# EAGLE design CanSharkV20 (EAGLE 6.3)

## Sheet 1 of 3
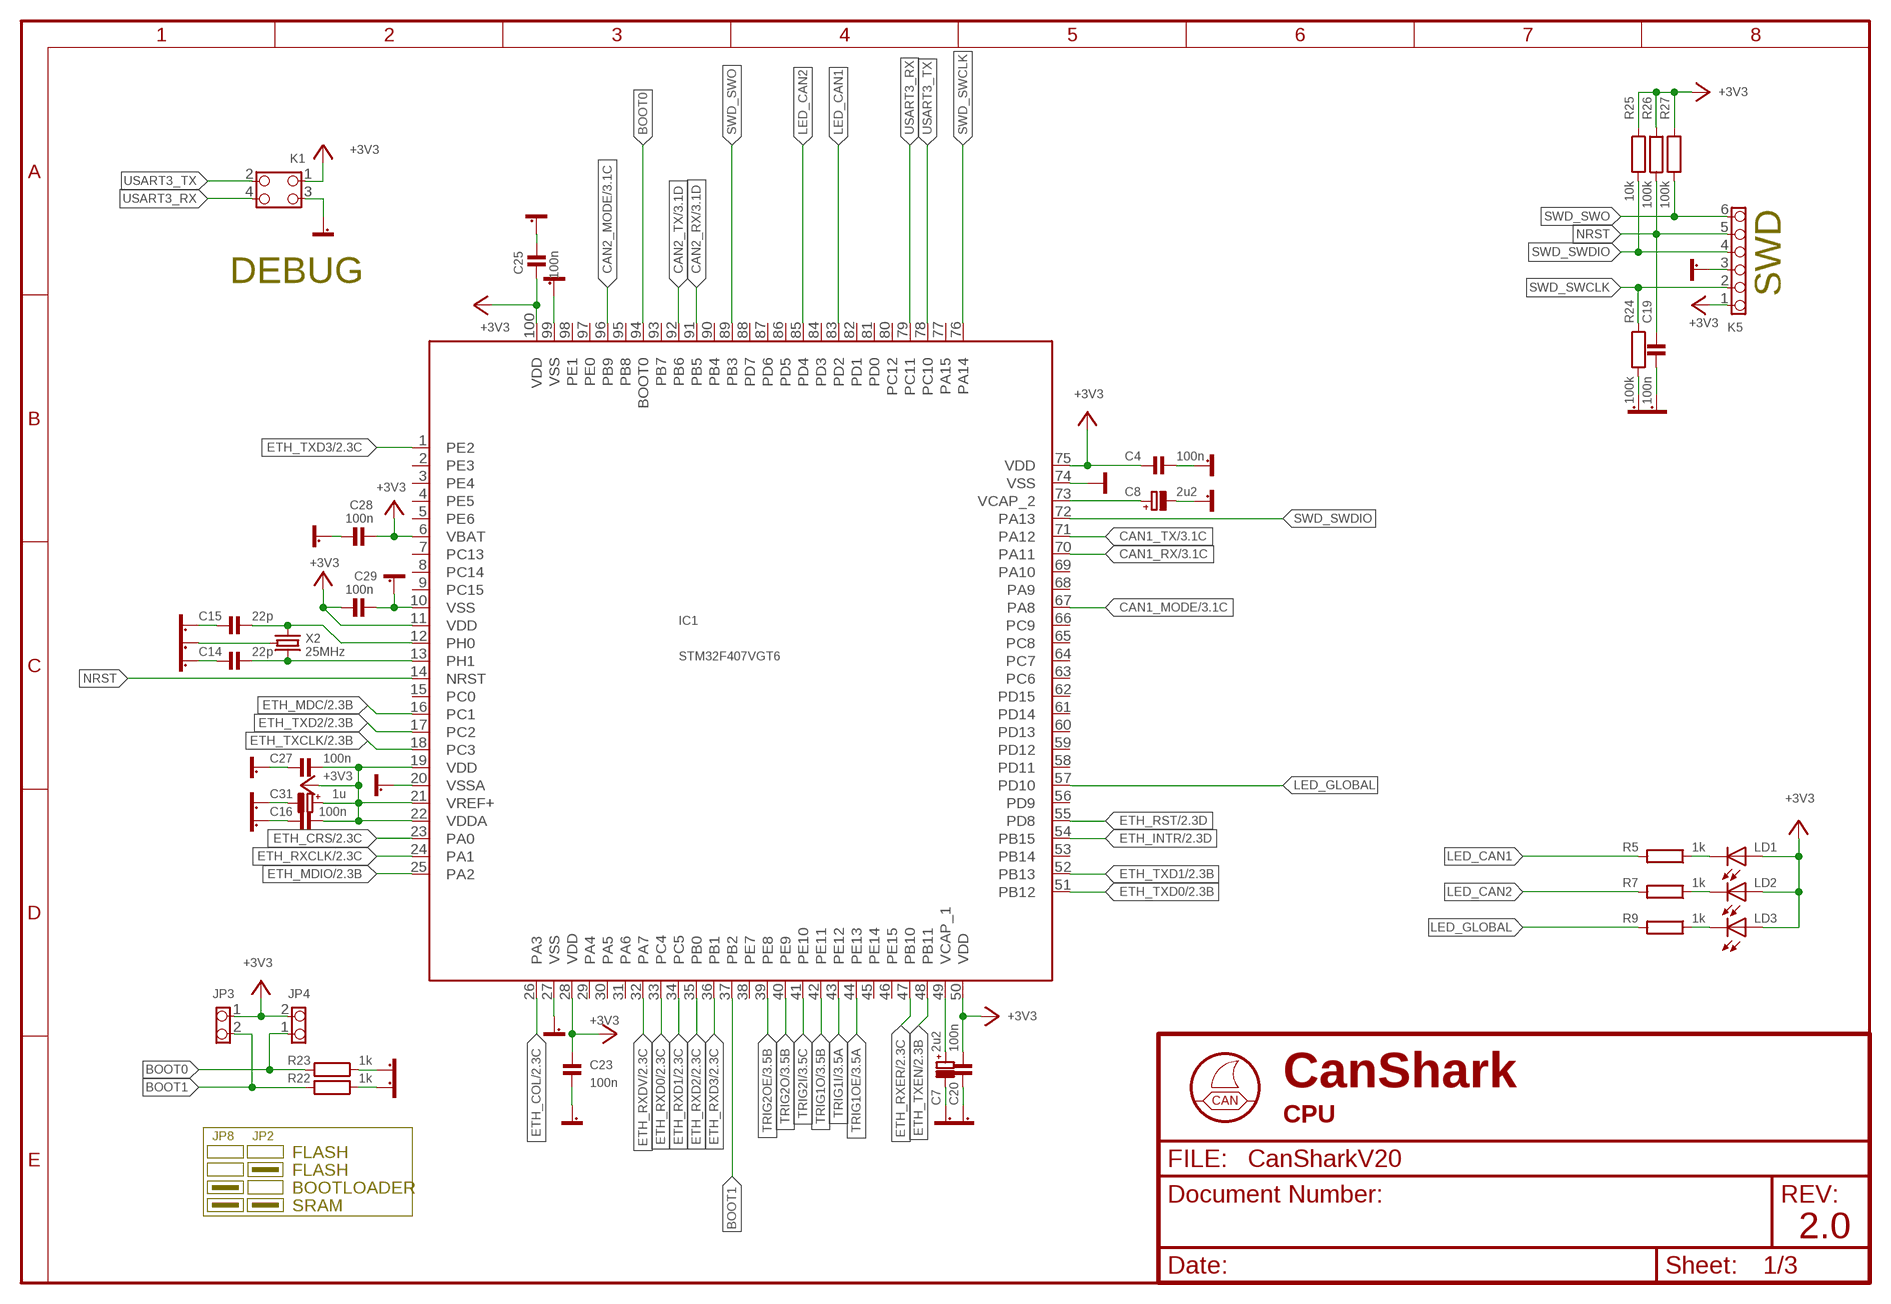
[diagram p0: schematic, sheet 1]

### Parts
C4  100n  C0603  [0603]
C7  2u2  CECT3216  [CT3216A]
C8  2u2  CECT3216  [CT3216A]
C14  22p  C0603  [0603]
C15  22p  C0603  [0603]
C16  100n  C0603  [0603]
C19  100n  C0603  [0603]
C20  100n  C0603  [0603]
C23  100n  C0603  [0603]
C25  100n  C0603  [0603]
C27  100n  C0603  [0603]
C28  100n  C0603  [0603]
C29  100n  C0603  [0603]
C31  1u  CECT3216  [CT3216A]
IC1  STM32F407VGT6  STM32F407V  [LQFP100]
JP3  PINHD-1X2  [1X02_254]
JP4  PINHD-1X2  [1X02_254]
K1  PINHD-2X2  [2X02_254]
K5  PINHD-1X6  [1X06_254]
LD1  TLLG4400  [LED3MM]
LD2  TLLG4400  [LED3MM]
LD3  TLLG4400  [LED3MM]
R5  1k  R_R0603  [0603]
R7  1k  R_R0603  [0603]
R9  1k  R_R0603  [0603]
R22  1k  R_R0603  [0603]
R23  1k  R_R0603  [0603]
R24  100k  R_R0603  [0603]
R25  100k  R_R0603  [0603]
R26  10k  R_R0603  [0603]
R27  100k  R_R0603  [0603]
X2  25MHz  X_GND_XT324  [X_XT324]

### Nets
+3V3: C4.2 C16.1 C20.1 C23.1 C25.2 C27.1 C28.2 C29.2 C31.+ IC1.6(VBAT) IC1.11(VDD) IC1.19(VDD) IC1.21(VREF+) IC1.22(VDDA) IC1.28(VDD) IC1.50(VDD) IC1.75(VDD) IC1.100(VDD) JP3.1 JP4.2 K1.1 K5.1 LD1.A LD2.A LD3.A R25.1 R26.2 R27.1 ; also sheet 2,3
BOOT0: IC1.94(BOOT0) JP4.1 R23.2
BOOT1: IC1.37(PB2) JP3.2 R22.2
CAN1_MODE: IC1.67(PA8) ; also sheet 3
CAN1_RX: IC1.70(PA11) ; also sheet 3
CAN1_TX: IC1.71(PA12) ; also sheet 3
CAN2_MODE: IC1.96(PB9) ; also sheet 3
CAN2_RX: IC1.91(PB5) ; also sheet 3
CAN2_TX: IC1.92(PB6) ; also sheet 3
ETH_COL: IC1.26(PA3) ; also sheet 2
ETH_CRS: IC1.23(PA0) ; also sheet 2
ETH_INTR: IC1.54(PB15) ; also sheet 2
ETH_MDC: IC1.16(PC1) ; also sheet 2
ETH_MDIO: IC1.25(PA2) ; also sheet 2
ETH_RST: IC1.55(PD8) ; also sheet 2
ETH_RXCLK: IC1.24(PA1) ; also sheet 2
ETH_RXD0: IC1.33(PC4) ; also sheet 2
ETH_RXD1: IC1.34(PC5) ; also sheet 2
ETH_RXD2: IC1.35(PB0) ; also sheet 2
ETH_RXD3: IC1.36(PB1) ; also sheet 2
ETH_RXDV: IC1.32(PA7) ; also sheet 2
ETH_RXER: IC1.47(PB10) ; also sheet 2
ETH_TXCLK: IC1.18(PC3) ; also sheet 2
ETH_TXD0: IC1.51(PB12) ; also sheet 2
ETH_TXD1: IC1.52(PB13) ; also sheet 2
ETH_TXD2: IC1.17(PC2) ; also sheet 2
ETH_TXD3: IC1.1(PE2) ; also sheet 2
ETH_TXEN: IC1.48(PB11) ; also sheet 2
GND: IC1.74(VSS)
GND1: C4.1 C7.- C8.- C14.2 C15.2 C16.2 C19.2 C20.2 C23.2 C25.1 C27.2 C28.1 C29.1 C31.- IC1.10(VSS) IC1.20(VSSA) IC1.27(VSS) IC1.99(VSS) K1.3 K5.3 R22.1 R23.1 R24.2 X2.2(G) X2.4(G) ; also sheet 2,3
LED_CAN1: IC1.83(PD2) R5.2
LED_CAN2: IC1.85(PD4) R7.2
LED_GLOBAL: IC1.57(PD10) R9.2
N$2: C7.+ IC1.49(VCAP_1)
N$4: C8.+ IC1.73(VCAP_2)
N$14: LD1.K(C) R5.1
N$20: LD2.K(C) R7.1
N$21: LD3.K(C) R9.1
NRST: C19.1 IC1.14(NRST) K5.5 R26.1
OSC_IN: C15.1 IC1.12(PH0) X2.1
OSC_OUT: C14.1 IC1.13(PH1) X2.3
SWD_SWCLK: IC1.76(PA14) K5.2 R24.1
SWD_SWDIO: IC1.72(PA13) K5.4 R25.2
SWD_SWO: IC1.89(PB3) K5.6 R27.2
TRIG1I: IC1.43(PE12) ; also sheet 3
TRIG1O: IC1.42(PE11) ; also sheet 3
TRIG1OE: IC1.44(PE13) ; also sheet 3
TRIG2I: IC1.41(PE10) ; also sheet 3
TRIG2O: IC1.40(PE9) ; also sheet 3
TRIG2OE: IC1.39(PE8) ; also sheet 3
USART3_RX: IC1.79(PC11) K1.4
USART3_TX: IC1.78(PC10) K1.2
Unconnected: IC1.2(PE3) IC1.3(PE4) IC1.4(PE5) IC1.5(PE6) IC1.7(PC13) IC1.8(PC14) IC1.9(PC15) IC1.15(PC0) IC1.29(PA4) IC1.30(PA5) IC1.31(PA6) IC1.38(PE7) IC1.45(PE14) IC1.46(PE15) IC1.53(PB14) IC1.56(PD9) IC1.58(PD11) IC1.59(PD12) IC1.60(PD13) IC1.61(PD14) IC1.62(PD15) IC1.63(PC6) IC1.64(PC7) IC1.65(PC8) IC1.66(PC9) IC1.68(PA9) IC1.69(PA10) IC1.77(PA15) IC1.80(PC12) IC1.81(PD0) IC1.82(PD1) IC1.84(PD3) IC1.86(PD5) IC1.87(PD6) IC1.88(PD7) IC1.90(PB4) IC1.93(PB7) IC1.95(PB8) IC1.97(PE0) IC1.98(PE1)

### Notes on the sheet
- DEBUG
- SWD
- CanShark
- CAN
- CPU
- JP8 | JP2
- FLASH
- FLASH
- BOOTLOADER
- SRAM
- 2.0

## Sheet 2 of 3
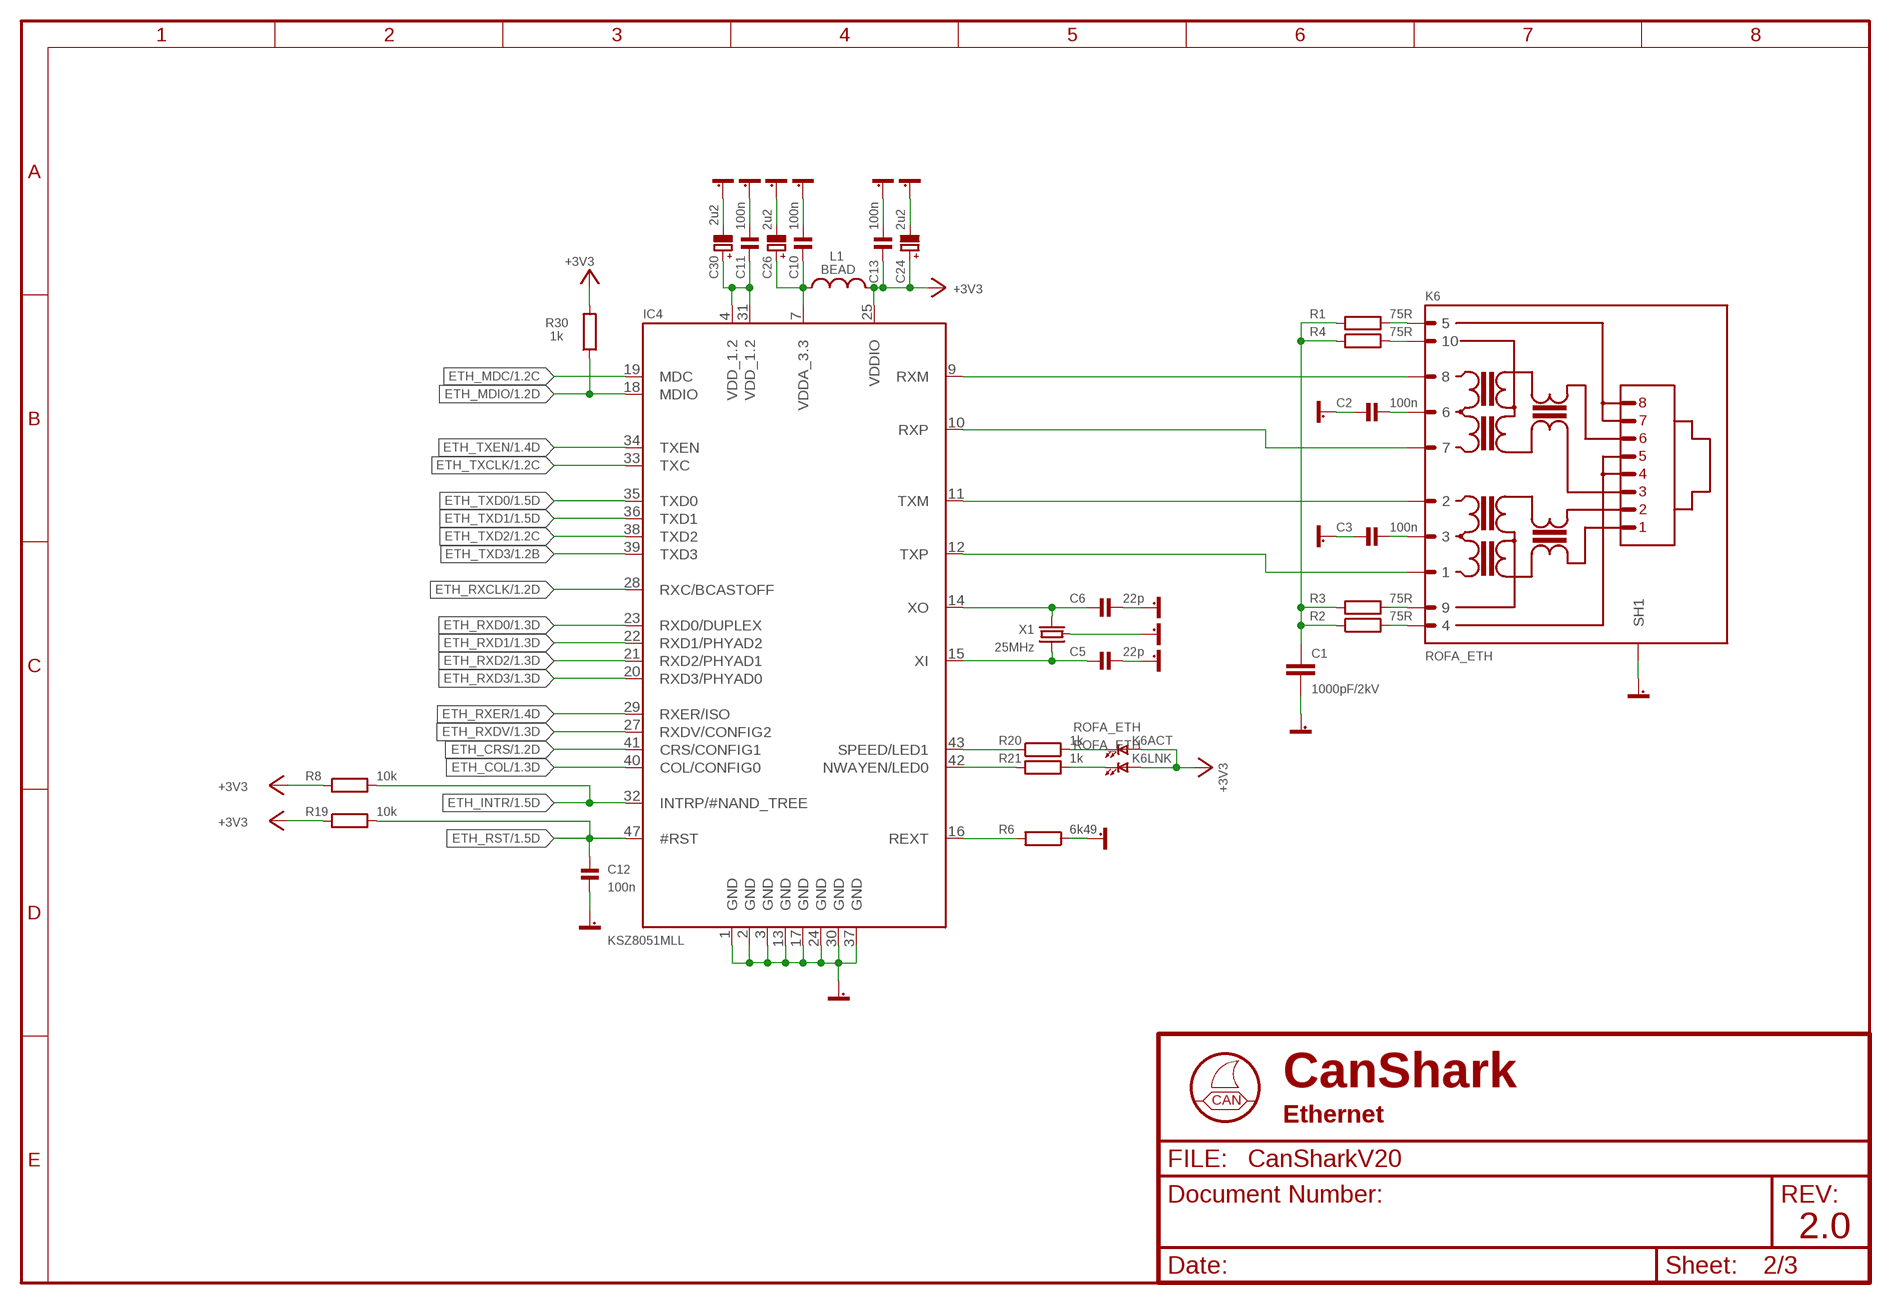
[diagram p1: schematic, sheet 2]

### Parts
C1  1000pF/2kV  KERAMICKYSMD1206  [SMD1206]
C2  100n  C0603  [0603]
C3  100n  C0603  [0603]
C5  22p  C0603  [0603]
C6  22p  C0603  [0603]
C10  100n  C0603  [0603]
C11  100n  C0603  [0603]
C12  100n  C0603  [0603]
C13  100n  C0603  [0603]
C24  2u2  CECT3216  [CT3216A]
C26  2u2  CECT3216  [CT3216A]
C30  2u2  CECT3216  [CT3216A]
IC4  KSZ8051MLL  [LQFP48]
K6  ROFA_ETH  RJ45_TRAFO  [RJ45_TRAFO]
L1  BEAD  L1206  [1206]
R1  75R  R_R0603  [0603]
R2  75R  R_R0603  [0603]
R3  75R  R_R0603  [0603]
R4  75R  R_R0603  [0603]
R6  6k49  R_R0603  [0603]
R8  10k  R_R0603  [0603]
R19  10k  R_R0603  [0603]
R20  1k  R_R0603  [0603]
R21  1k  R_R0603  [0603]
R30  1k  R_R0603  [0603]
X1  25MHz  X_GND_XT324  [X_XT324]

### Nets
+3V3: C13.2 C24.+ IC4.25(VDDIO) K6.A_G(A) K6.A_Y(A) L1.1 R8.1 R19.1 R30.2 ; also sheet 1,3
ETH_COL: IC4.40(COL/CONFIG0) ; also sheet 1
ETH_CRS: IC4.41(CRS/CONFIG1) ; also sheet 1
ETH_INTR: IC4.32(INTRP/#NAND_TREE) R8.2 ; also sheet 1
ETH_MDC: IC4.19(MDC) ; also sheet 1
ETH_MDIO: IC4.18(MDIO) R30.1 ; also sheet 1
ETH_RST: C12.1 IC4.47(#RST) R19.2 ; also sheet 1
ETH_RXCLK: IC4.28(RXC/BCASTOFF) ; also sheet 1
ETH_RXD0: IC4.23(RXD0/DUPLEX) ; also sheet 1
ETH_RXD1: IC4.22(RXD1/PHYAD2) ; also sheet 1
ETH_RXD2: IC4.21(RXD2/PHYAD1) ; also sheet 1
ETH_RXD3: IC4.20(RXD3/PHYAD0) ; also sheet 1
ETH_RXDV: IC4.27(RXDV/CONFIG2) ; also sheet 1
ETH_RXER: IC4.29(RXER/ISO) ; also sheet 1
ETH_TXCLK: IC4.33(TXC) ; also sheet 1
ETH_TXD0: IC4.35(TXD0) ; also sheet 1
ETH_TXD1: IC4.36(TXD1) ; also sheet 1
ETH_TXD2: IC4.38(TXD2) ; also sheet 1
ETH_TXD3: IC4.39(TXD3) ; also sheet 1
ETH_TXEN: IC4.34(TXEN) ; also sheet 1
GND1: C1.2 C2.1 C3.1 C5.1 C6.1 C10.1 C11.1 C12.2 C13.1 C24.- C26.- C30.- IC4.1(GND) IC4.2(GND) IC4.3(GND) IC4.13(GND) IC4.17(GND) IC4.24(GND) IC4.30(GND) IC4.37(GND) K6.SH1 K6.SH2(SH1) R6.1 X1.2(G) X1.4(G) ; also sheet 1,3
N$3: K6.K_Y(K) R20.2
N$8: K6.K_G(K) R21.2
N$9: C10.2 C26.+ IC4.7(VDDA_3.3) L1.2
N$36: C11.2 C30.+ IC4.4(VDD_1.2) IC4.31(VDD_1.2)
N$37: IC4.9(RXM) K6.8
N$38: IC4.10(RXP) K6.7
N$39: IC4.11(TXM) K6.2
N$40: IC4.12(TXP) K6.1
N$41: K6.4 R2.2
N$42: K6.9 R3.2
N$43: K6.10 R4.2
N$44: K6.5 R1.2
N$45: C1.1 R1.1 R2.1 R3.1 R4.1
N$46: C2.2 K6.6
N$47: C3.2 K6.3
N$49: IC4.16(REXT) R6.2
N$50: IC4.42(NWAYEN/LED0) R21.1
N$51: IC4.43(SPEED/LED1) R20.1
N$55: C6.2 IC4.14(XO) X1.3
N$56: C5.2 IC4.15(XI) X1.1

### Notes on the sheet
- CanShark
- CAN
- Ethernet
- 2.0

## Sheet 3 of 3
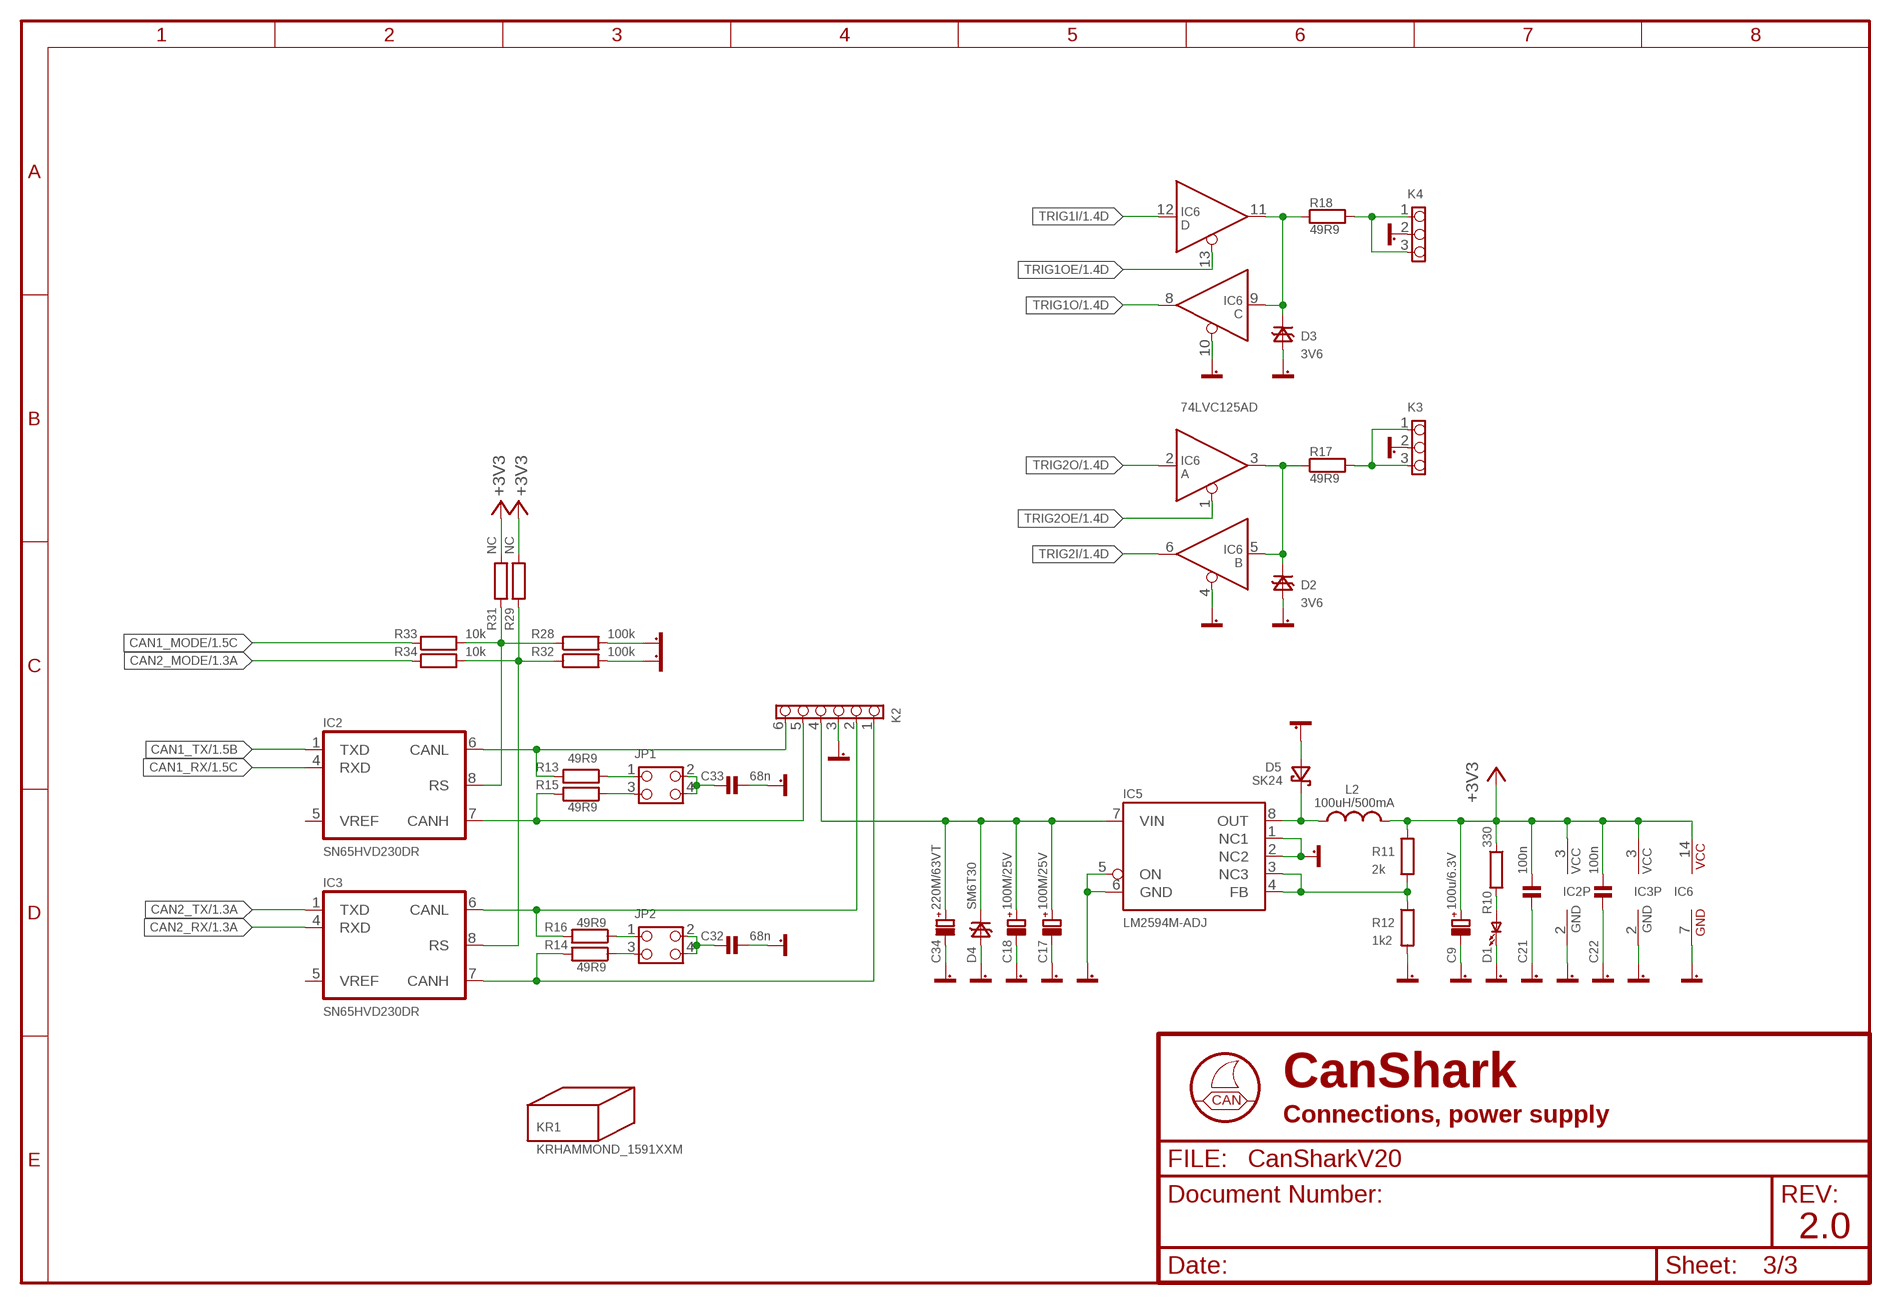
[diagram p2: schematic, sheet 3]

### Parts
C9  100u/6.3V  CECT3528  [CT3528B]
C17  100M/25V  CECT7343  [CT7343D]
C18  100M/25V  CECT7343  [CT7343D]
C21  100n  C0603  [0603]
C22  100n  C0603  [0603]
C32  68n  C0805  [0805]
C33  68n  C0805  [0805]
C34  220M/63VT  CE_D10L13_R  [CE_D10L13_R]
D1  LED0805  [LED_0805]
D2  3V6  D_TRANSIL_SMA  [D_SMA]
D3  3V6  D_TRANSIL_SMA  [D_SMA]
D4  SM6T30  D_TRANSIL_SMB  [D_SMB]
D5  SK24  D_SCHOTKY_SMB  [D_SMB]
IC2  SN65HVD230DR  MCP2551/S  [SO08]
IC3  SN65HVD230DR  MCP2551/S  [SO08]
IC5  LM2594M-ADJ  LM2594_SO  [SO08]
IC6  74LVC125AD  [SO14]
JP1  PINHD-2X2_254_EDGE  [2X02_254_EDGE]
JP2  PINHD-2X2_254_EDGE  [2X02_254_EDGE]
K2  PINHD-1X6_381_V  [1X06_381_V]
K3  PINHD-1X3  [1X03_254]
K4  PINHD-1X3  [1X03_254]
KR1  KRHAMMOND_1591XXM  [HAMMOND_1591XXM]
L2  100uH/500mA  L_MLC12XX  [L_MLC12XX]
R10  330  R_R0603  [0603]
R11  2k  R_R0603  [0603]
R12  1k2  R_R0603  [0603]
R13  49R9  R_R0805  [0805]
R14  49R9  R_R0805  [0805]
R15  49R9  R_R0805  [0805]
R16  49R9  R_R0805  [0805]
R17  49R9  R_R0805  [0805]
R18  49R9  R_R0805  [0805]
R28  100k  R_R0603  [0603]
R29  NC  R_R0603  [0603]
R31  NC  R_R0603  [0603]
R32  100k  R_R0603  [0603]
R33  10k  R_R0603  [0603]
R34  10k  R_R0603  [0603]

### Nets
+3V3: C9.+ C21.1 C22.1 IC2.3(VCC) IC3.3(VCC) IC6.14(P:VCC) L2.2 R10.1 R11.1 R29.1 R31.1 ; also sheet 1,2
CAN1_H: IC2.7(CANH) K2.5 R15.2
CAN1_L: IC2.6(CANL) K2.6 R13.2
CAN1_MODE: R33.1 ; also sheet 1
CAN1_RX: IC2.4(RXD) ; also sheet 1
CAN1_TX: IC2.1(TXD) ; also sheet 1
CAN2_H: IC3.7(CANH) K2.1 R14.2
CAN2_L: IC3.6(CANL) K2.2 R16.2
CAN2_MODE: R34.1 ; also sheet 1
CAN2_RX: IC3.4(RXD) ; also sheet 1
CAN2_TX: IC3.1(TXD) ; also sheet 1
EXTSUPPLY: C17.+ C18.+ C34.P(+) D4.K IC5.7(VIN) K2.4
GND1: C9.- C17.- C18.- C21.2 C22.2 C32.1 C33.1 C34.M(-) D1.K(C) D2.A D3.A D4.A D5.A IC2.2(GND) IC3.2(GND) IC5.1(NC1) IC5.2(NC2) IC5.5(ON) IC5.6(GND) IC6.4(B:OE) IC6.7(P:GND) IC6.10(C:OE) K2.3 K3.2 K4.2 R12.2 R28.2 R32.2 ; also sheet 1,2
N$1: D2.K IC6.3(A:Y) IC6.5(B:A) R17.1
N$5: JP2.1 R16.1
N$7: D1.A R10.2
N$10: JP2.3 R14.1
N$11: C32.2 JP2.2 JP2.4
N$12: IC2.8(RS) R28.1 R31.2 R33.2
N$16: JP1.1 R13.1
N$17: IC3.8(RS) R29.2 R32.1 R34.2
N$18: JP1.3 R15.1
N$19: C33.2 JP1.2 JP1.4
N$22: K4.1 K4.3 R18.2
N$24: K3.1 K3.3 R17.2
N$28: D5.K IC5.8(OUT) L2.1
N$29: IC5.3(NC3) IC5.4(FB) R11.2 R12.1
N$30: D3.K IC6.9(C:A) IC6.11(D:Y) R18.1
TRIG1I: IC6.12(D:A) ; also sheet 1
TRIG1O: IC6.8(C:Y) ; also sheet 1
TRIG1OE: IC6.13(D:OE) ; also sheet 1
TRIG2I: IC6.6(B:Y) ; also sheet 1
TRIG2O: IC6.2(A:A) ; also sheet 1
TRIG2OE: IC6.1(A:OE) ; also sheet 1
Unconnected: IC2.5(VREF) IC3.5(VREF)

### Notes on the sheet
- CanShark
- CAN
- Connections, power supply
- 2.0

## Library data of the parts
C1 = #Kondenzatory:KERAMICKY
C2-C6 C10-C16 C19-C23 C25 C27-C29 C32 C33 = !discrete:C: Kondenzator
C7-C9 C17 C18 C24 C26 C30 C31 C34 = !discrete:CE: Kondenzator Elektrolyt
D1 = !opto:LED: Dioda LED
D2 D3 = !discrete:D_TRANSIL: Transil Jednosmerny Typ Urm @ Irm Ubr @ Ibr Ucl @ Ipp Pouzdro SM6T30A 25.6V (1uA) 30V (1mA) 53V (75A) DO214AA (SMB)
D4 = !diody:D_TRANSIL: Transil Jednosmerny Typ Urm @ Irm Ubr @ Ibr Ucl @ Ipp Pouzdro SM6T30A 25.6V (1uA) 30V (1mA) 53V (75A) DO214AA (SMB)
D5 = !discrete:D_SCHOTKY: Dioda Schottkyho Typ Ur (Urpk] Uf I (Ipk] Pouzdro SD103B 30 V 200 mA DO35 BAT42 30 V 200 mA DO35 BAT43 30 V 200 mA DO35 BAT46 100 V 150 mA DO35 BAT47 20 V 350 mA DO35 BAT48 40 V 350 mA DO35 SK24 40 V (28V) 0.55V 2A (50A) DO214AA (SMB) SK26 60 V 0.65V 2A (50A) DO214AA (SMB)
IC1 = !ic_stm32:STM32F4*V: IC Mikrokontroler
IC2 IC3 = linear:MCP2551: IO - Budic
IC4 = !ic_micrel:KSZ8051MLL: IO - Ethernet PHY
IC5 = !stab:LM2594: Stabilizator spinany
IC6 = !ic_74xx:74*125A: IO - Budic
JP1 JP2 K1 = !pinhead:PINHD-2X2: Konektor 2 PIN dvourady
JP3 JP4 = !pinhead:PINHD-1X2: Konektor 2 PIN Typ Rastr Imax Umax Rmax Kontakt 2.54 mm 500 mA 125 V 50 mOhm krimp /90 2.54 mm 500 mA 125 V 50 mOhm krimp _MX5267 2.50 mm 2.5 A 250 V 20 mOhm krimp _MX53048 1.25 mm 800 mA 125 V 20 mOhm krimp _PV-3.81 3.81 mm 8 A 130 V 30 mOhm ?roub
K2 K5 = !pinhead:PINHD-1X6: Konektor 6 PIN Typ Rastr Imax Umax Rmax Kontakt 2.54 mm 500 mA 125 V 50 mOhm krimp /90 2.54 mm 500 mA 125 V 50 mOhm krimp _MX5267 2.50 mm 2.5 A 250 V 20 mOhm krimp _MX53048 1.25 mm 800 mA 125 V 20 mOhm krimp _PV-3.81 3.81 mm 8 A 130 V 30 mOhm Sroub _MPT 2.54 mm 6 A 125 V unspecified Sroub
K3 K4 = !pinhead:PINHD-1X3: Konektor 3 PIN Typ Rastr Imax Umax Rmax Kontakt 2.54 mm 500 mA 125 V 50 mOhm krimp /90 2.54 mm 500 mA 125 V 50 mOhm krimp _MX5267 2.50 mm 2.5 A 250 V 20 mOhm krimp _MX53048 1.25 mm 800 mA 125 V 20 mOhm krimp _PV-3.81 3.81 mm 8 A 130 V 30 mOhm ?roub
K6 = !konektor:RJ45_TRAFO: Konektor RJ45 RJ45 socket with LED and transofrmator Manufaturer: Wenzhou Yihua Communicated Connector Co. Ltd. Forward current LED = 20mA Typical voltage: Green LED Yellow LED 2.2V 2.1V c 2007 ROFA.CZ
KR1 = !krabicky:KR: Krabicka
L1 L2 = !discrete:L: Indukcnost
LD1-LD3 = led:TLLG4400: Low Current (2mA) LED 3 mm Tinted Diffused Package color GREEN Source: Data sheet <http://www.farnell.com/datasheets/391098.pdf>; MF: VISHAY SEMICONDUCTOR; OC_FARNELL: 1612435
R1-R34 = !discrete:R_: Rezistor
X1 X2 = !discrete:X_GND

## Board
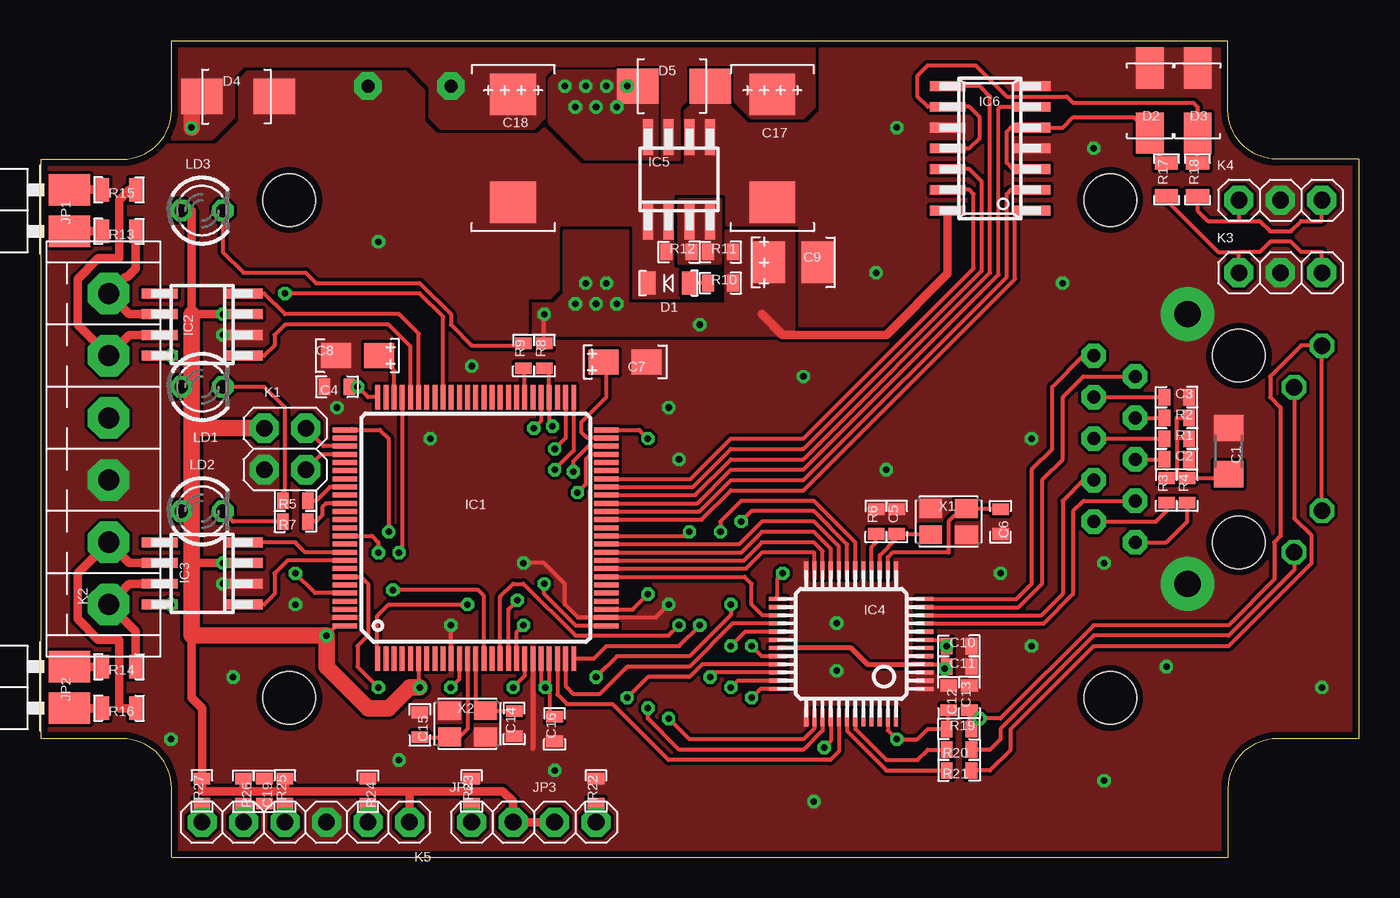
[diagram p3: board, top side]
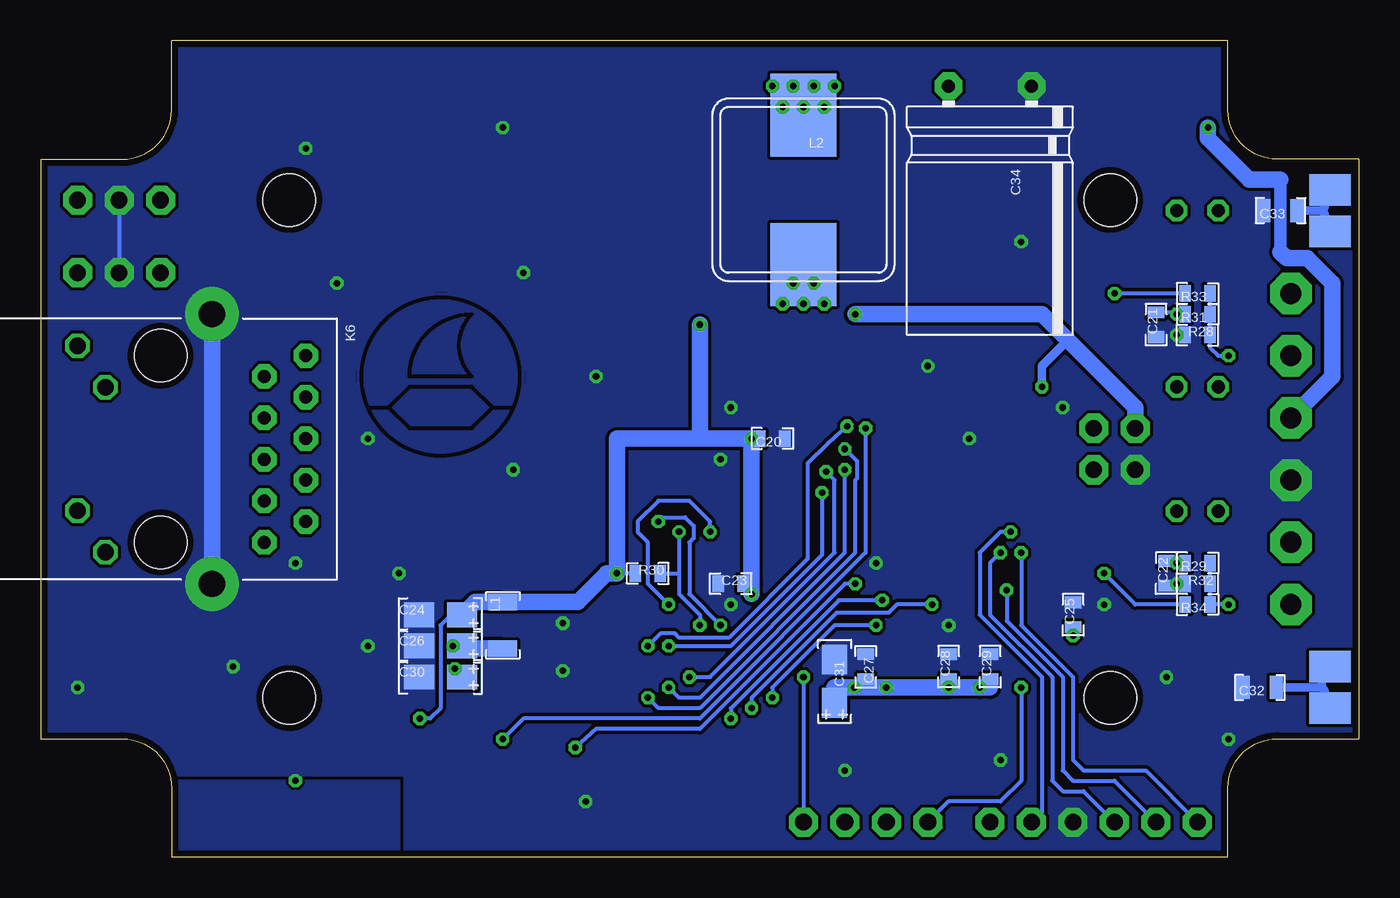
[diagram p4: board, bottom side, seen from below]

Size 80.7 x 50 mm. Coordinates in mm from the lower left corner, seen from the top.
Copper layers (1*16): Top 0.035mm / dielectric 1.5mm / Bottom 0.035mm
Design rules "default *": minimum track width 8mil, minimum drill 0.4mm, track to track 6mil, track to pad 6mil, pad to pad 6mil, via to via 6mil, smd to smd 0mil, copper to edge 0.4mm, drill to drill 8mil, minimum pad ring 10mil, minimum via ring 8mil, stop-mask expansion 4mil, vias tented up to drill 0mil, thermal gap 10mil
bRestrict: area 51.4,24.6 to 61.1,34.3; 11 lines

### Footprints (pad centres in the part's own frame; a part is rotated, then mirrored left to right if it is on the bottom)
SMD1206 = smd 1.6 x 1.803: 1 -1.422,0; 2 1.422,0
0603 = smd 0.711 x 1.016: 1 -0.762,0; 2 0.762,0
CT3216A = smd 1.829 x 1.524: + -1.321,0; - 1.321,0
CT3528B = smd 2.032 x 2.54: + -1.524,0; - 1.524,0
CT7343D = smd 2.54 x 2.794: + -3.302,0; - 3.302,0
0805 = smd 0.813 x 1.422: 1 -1.016,0; 2 1.016,0
CE_D10L13_R = drill 0.8 pad 1.676 octagon: M 0,2.54; P 0,-2.54
LED_0805 = smd 0.914 x 1.422: A -1.27,0; K 1.27,0
D_SMA = smd 2.515 x 1.702: A 2,0; K -2,0
D_SMB = smd 2.54 x 2.159: A 2.54,0; K -1.905,0
LQFP100 = smd 1.5 x 0.3: 1 -8,6; 2 -8,5.5; 3 -8,5; 4 -8,4.5; 5 -8,4; 6 -8,3.5; 7 -8,3; 8 -8,2.5; 9 -8,2; 10 -8,1.5; 11 -8,1; 12 -8,0.5; 13 -8,0; 14 -8,-0.5; 15 -8,-1; 16 -8,-1.5; 17 -8,-2; 18 -8,-2.5; 19 -8,-3; 20 -8,-3.5; 21 -8,-4; 22 -8,-4.5; 23 -8,-5; 24 -8,-5.5; 25 -8,-6; 51 8,-6; 52 8,-5.5; 53 8,-5; 54 8,-4.5; 55 8,-4; 56 8,-3.5; 57 8,-3; 58 8,-2.5; 59 8,-2; 60 8,-1.5; 61 8,-1; 62 8,-0.5; 63 8,0; 64 8,0.5; 65 8,1; 66 8,1.5; 67 8,2; 68 8,2.5; 69 8,3; 70 8,3.5; 71 8,4; 72 8,4.5; 73 8,5; 74 8,5.5; 75 8,6 | smd 0.3 x 1.5: 26 -6,-8; 27 -5.5,-8; 28 -5,-8; 29 -4.5,-8; 30 -4,-8; 31 -3.5,-8; 32 -3,-8; 33 -2.5,-8; 34 -2,-8; 35 -1.5,-8; 36 -1,-8; 37 -0.5,-8; 38 0,-8; 39 0.5,-8; 40 1,-8; 41 1.5,-8; 42 2,-8; 43 2.5,-8; 44 3,-8; 45 3.5,-8; 46 4,-8; 47 4.5,-8; 48 5,-8; 49 5.5,-8; 50 6,-8; 76 6,8; 77 5.5,8; 78 5,8; 79 4.5,8; 80 4,8; 81 3.5,8; 82 3,8; 83 2.5,8; 84 2,8; 85 1.5,8; 86 1,8; 87 0.5,8; 88 0,8; 89 -0.5,8; 90 -1,8; 91 -1.5,8; 92 -2,8; 93 -2.5,8; 94 -3,8; 95 -3.5,8; 96 -4,8; 97 -4.5,8; 98 -5,8; 99 -5.5,8; 100 -6,8
SO08 = smd 0.6 x 2.2: 1 -1.905,-2.6; 2 -0.635,-2.6; 3 0.635,-2.6; 4 1.905,-2.6; 5 1.905,2.6; 6 0.635,2.6; 7 -0.635,2.6; 8 -1.905,2.6
LQFP48 = smd 0.254 x 1.067: 1 -2.75,-4.504; 2 -2.25,-4.504; 3 -1.75,-4.504; 4 -1.25,-4.504; 5 -0.75,-4.504; 6 -0.25,-4.504; 7 0.25,-4.504; 8 0.75,-4.504; 9 1.25,-4.504; 10 1.75,-4.504; 11 2.25,-4.504; 12 2.75,-4.504; 25 2.75,4.504; 26 2.25,4.504; 27 1.75,4.504; 28 1.25,4.504; 29 0.75,4.504; 30 0.25,4.504; 31 -0.25,4.504; 32 -0.75,4.504; 33 -1.25,4.504; 34 -1.75,4.504; 35 -2.25,4.504; 36 -2.75,4.504 | smd 1.067 x 0.254: 13 4.504,-2.75; 14 4.504,-2.25; 15 4.504,-1.75; 16 4.504,-1.25; 17 4.504,-0.75; 18 4.504,-0.25; 19 4.504,0.25; 20 4.504,0.75; 21 4.504,1.25; 22 4.504,1.75; 23 4.504,2.25; 24 4.504,2.75; 37 -4.504,2.75; 38 -4.504,2.25; 39 -4.504,1.75; 40 -4.504,1.25; 41 -4.504,0.75; 42 -4.504,0.25; 43 -4.504,-0.25; 44 -4.504,-0.75; 45 -4.504,-1.25; 46 -4.504,-1.75; 47 -4.504,-2.25; 48 -4.504,-2.75
SO14 = smd 0.6 x 2.2: 1 -3.81,-2.6; 2 -2.54,-2.6; 3 -1.27,-2.6; 4 0,-2.6; 5 1.27,-2.6; 6 2.54,-2.6; 7 3.81,-2.6; 8 3.81,2.6; 9 2.54,2.6; 10 1.27,2.6; 11 0,2.6; 12 -1.27,2.6; 13 -2.54,2.6; 14 -3.81,2.6
2X02_254_EDGE = smd 1.93 x 2.54: 1 0,-1.778; 3 2.54,-1.778 | smd 1.93 x 2.54 bottom: 2 0,-1.778; 4 2.54,-1.778
1X02_254 = drill 1.016 pad 1.778 octagon: 1 -1.27,0; 2 1.27,0
2X02_254 = drill 1.016 pad 1.778 octagon: 1 -1.27,-1.27; 2 -1.27,1.27; 3 1.27,-1.27; 4 1.27,1.27
1X06_381_V = drill 1.3 pad 2.54 octagon: 1 0,0; 2 3.81,0; 3 7.62,0; 4 11.43,0; 5 15.24,0; 6 19.05,0
1X03_254 = drill 1.016 pad 1.778 octagon: 1 -2.54,0; 2 0,0; 3 2.54,0
1X06_254 = drill 1.016 pad 1.778 octagon: 1 -6.35,0; 2 -3.81,0; 3 -1.27,0; 4 1.27,0; 5 3.81,0; 6 6.35,0
RJ45_TRAFO = drill 0.8 pad 1.5 octagon: 1 -5.715,8.89; 2 -4.445,6.35; 3 -3.175,8.89; 4 -1.905,6.35; 5 -0.635,8.89; 6 0.635,6.35; 7 1.905,8.89; 8 3.175,6.35; 9 4.445,8.89; 10 5.715,6.35 | drill 1 pad 1.5 octagon: A_G -6.325,-5.08; A_Y 3.785,-5.08; K_G -3.785,-3.38; K_Y 6.325,-3.38 | drill 1.6 pad 3.3: SH1 -8.255,3.15; SH2 8.255,3.15 | hole 3.2: -5.715,0; 5.715,0
HAMMOND_1591XXM = hole 3.2: 25.135,-15.25; -25.135,-15.25; 25.135,15.25; -25.135,15.25
1206 = smd 1.016 x 1.778: 1 -1.422,0; 2 1.422,0
L_MLC12XX = smd 5.08 x 4.064: 1 -4.572,0; 2 4.572,0
LED3MM = drill 0.813 octagon: A -1.27,0; K 1.27,0
X_XT324 = smd 1.4 x 1.15: 1 -1.1,-0.8; 2 1.1,-0.8; 3 1.1,0.8; 4 -1.1,0.8

### Placement (x,y rotation side)
C1  72.73,24.87 90 top
C2  69.56,24.36 180 top
C3  69.56,28.18 180 top
C4  18.12,28.81 0 top
C5  52.41,20.55 270 top
C6  58.77,20.55 90 top
C7  35.78,30.33 0 top
C8  19.4,30.71 180 top
C9  46.06,36.43 0 top
C10  56.23,12.94 180 top
C11  56.23,11.66 180 top
C12  55.59,9.76 90 top
C13  56.86,9.76 270 top
C14  28.98,8.17 270 top
C15  23.21,8.11 90 top
C16  31.46,7.86 270 top
C17  44.8,43.41 270 top
C18  28.92,43.41 270 top
C19  13.68,4.05 90 top
C20  35.91,25.64 0 bottom
C21  12.41,32.62 270 bottom
C22  11.78,17.38 270 bottom
C23  38.45,16.74 180 bottom
C24  56.23,14.84 180 bottom
C25  17.49,14.84 270 bottom
C26  56.23,12.94 180 bottom
C27  30.19,11.66 90 bottom
C28  25.11,11.66 270 bottom
C29  22.57,11.66 270 bottom
C30  56.23,11.03 180 bottom
C31  32.09,10.78 90 bottom
C32  6.06,10.39 0 bottom
C33  4.79,39.61 0 bottom
C34  22.57,47.23 270 bottom
D1  38.45,35.16 180 top
D2  67.91,46.34 90 top
D3  70.83,46.34 90 top
D4  11.78,46.59 0 top
D5  38.45,47.23 0 top
IC1  26.63,20.17 90 top
IC2  9.87,32.62 90 top
IC3  9.87,17.38 90 top
IC4  49.62,13.06 90 top
IC5  39.08,41.51 0 top
IC6  58.13,43.41 90 top
JP1  -0.04,38.34 90 top
JP2  -0.04,9.12 90 top
JP3  32.73,2.14 0 top
JP4  27.65,2.14 0 top
K1  14.95,25 270 top
K2  4.16,15.47 90 top
K3  75.91,35.8 0 top
K4  75.91,40.24 0 top
K5  16.22,2.14 180 top
K6  73.37,25 270 bottom
KR1  40.35,25 0 top
L1  52.41,14.21 270 bottom
L2  34,40.88 270 bottom
LD1  9.87,28.81 0 top
LD2  9.87,21.19 0 top
LD3  9.87,39.61 0 top
R1  69.56,25.64 180 top
R2  69.56,26.91 180 top
R3  68.92,22.46 270 top
R4  70.19,22.46 270 top
R5  15.59,21.82 0 top
R6  51.15,20.55 270 top
R7  15.59,20.55 0 top
R8  30.83,30.71 270 top
R9  29.55,30.71 270 top
R10  41.62,35.16 180 top
R11  41.62,37.06 180 top
R12  39.08,37.06 180 top
R13  4.79,38.34 0 top
R14  4.79,11.66 0 top
R15  4.79,40.88 0 top
R16  4.79,9.12 0 top
R17  68.92,41.51 270 top
R18  70.83,41.51 270 top
R19  56.23,7.86 180 top
R20  56.23,6.59 0 top
R21  56.23,5.32 0 top
R22  34,4.05 270 top
R23  26.38,4.05 270 top
R24  20.03,4.05 90 top
R25  14.95,4.05 270 top
R26  12.41,4.05 90 top
R27  9.87,4.05 270 top
R28  9.87,31.98 180 bottom
R29  9.87,18.02 0 bottom
R30  43.52,17.38 180 bottom
R31  9.87,33.26 0 bottom
R32  9.87,16.74 180 bottom
R33  9.87,34.52 0 bottom
R34  9.87,15.47 0 bottom
X1  55.59,20.55 0 top
X2  26.13,8.17 0 top

### Tracks (layer width: path | path; a pad name or v marks a point on that pad's centre or on a via)
+3V3  (via drill 0.4)
  Top 0.254: R19.1 56.86,7.98 56.86,8.49 | 56.86,8.49 C13.2 | IC2.3 v11.14,33.26 | 25.62,12.16 25.62,10.9 v25.11,10.39 | IC1.6 23.13,10.47 v23.21,10.39 | IC1.100 18.09,14.17 v17.49,13.57 | IC1.19 29.63,11.11 v28.92,10.39 | IC1.21 30.63,10.65 v30.89,10.39 | IC1.22 31.13,10.64 v30.89,10.39 | v30.89,10.39 31.14,10.14 31.14,8.93 C16.1 | IC1.28 36.24,15.17 v37.18,16.11 | 56.86,8.49 v57.5,8.49 58.77,8.49 64.48,14.21 72.73,14.21 75.53,17 75.53,19.29 75.91,19.67 75.91,27.54 75.28,28.18 75.28,29.45 77.18,31.35 78.45,31.35 K6.A_G K6.A_Y | IC1.50 36.64,26.17 v37.18,25.64 | IC3.3 v11.14,18.02 | IC1.75 20.03,28.17 v19.4,28.81 C4.2 | IC4.25 45.12,17.07 v45.43,17.38 | R8.1 v30.83,33.26
  Top 0.305: 25.62,12.16 IC1.11
  Top 0.508: JP3.1 JP4.2 28.92,3.41 28.29,4.05 22.57,4.05 | 22.57,4.05 K5.1 | 22.57,4.05 14.95,4.05 | 14.95,4.05 12.41,4.05 | 12.41,4.05 9.87,4.05 R27.1 9.87,9.12 9.24,9.76 9.24,13.57 | R26.2 12.41,4.05 | R25.1 14.95,4.05 | 9.24,18.02 v11.14,18.02 | v11.14,33.26 9.24,33.26 9.24,39.61 LD3.A | IC6.14 55.53,35.73 51.78,31.98 45.43,31.98 44.16,33.26
  Top 1.016: v23.21,10.39 22.57,10.39 21.3,9.12 20.03,9.12 17.49,11.66 v17.49,13.57 9.24,13.57 9.24,18.02 9.24,21.19 | 9.24,26.27 K1.1 | 9.24,26.27 9.24,21.19 | LD1.A 9.24,28.81 | 9.24,28.81 9.24,26.27 | 9.24,28.81 9.24,33.26 | LD2.A 9.24,21.19
  Bottom 0.254: R31.1 v11.14,33.26 11.27,33.38 C21.1 | v25.11,10.39 C28.2 | v17.49,13.57 C25.2 | C29.2 22.57,10.39 | C27.1 30.19,10.39 | v37.18,25.64 C20.1 | v33.37,35.16 34,35.16 L2.2 | C24.+ 55.59,14.84 56.23,14.21 56.23,9.12 56.86,8.49 v57.5,8.49 | R30.2 v45.43,17.38 | C23.1 37.18,16.74 | R29.1 v11.14,18.02 11.27,18.14 C22.1
  Bottom 0.508: v19.4,28.81 19.4,30.08 17.81,31.67
  Bottom 1.016: C24.+ 54.12,15.63 L1.1 47.82,15.63 46.06,17.38 v45.43,17.38 45.43,25.64 40.35,25.64 | 22.57,10.39 v23.21,10.39 v25.11,10.39 v28.92,10.39 30.19,10.39 v30.89,10.39 32.09,10.39 C31.+ | v37.18,16.11 37.18,16.74 v37.18,25.64 40.35,25.64 | v30.83,33.26 19.4,33.26 17.81,31.67 13.68,27.54 K1.1 | 40.35,25.64 v40.35,32.62
  other vias: 34.64,35.16 34,33.89 35.27,33.89 32.73,33.89
  pour Top (rank 2, no thermals): 42,38.34 46.06,38.34 46.06,31.98 30.19,31.98 30.19,33.89 31.46,33.89 32.09,34.52 32.09,38.34 35.91,38.34 35.91,33.89 42,33.89
BOOT0  (via drill 0.4)
  Top 0.254: IC1.94 19.6,17.17 20.03,16.74 20.03,13.57 19.4,12.94 19.4,11.66 v20.67,10.39 | R23.2 JP4.1
  Bottom 0.254: v20.67,10.39 20.67,4.68 21.94,3.41 25.11,3.41 JP4.1
BOOT1  (via drill 0.4)
  Top 0.254: IC1.37 39.47,19.67 v39.72,19.92 | v42.26,15.47 42.26,14.84 39.72,12.3 35.27,12.3 v34,11.03 | R22.2 JP3.2
  Bottom 0.254: v39.72,19.92 39.72,20.55 40.98,21.82 42.89,21.82 44.16,20.55 44.16,19.92 43.52,19.29 43.52,16.74 v42.26,15.47 | v34,11.03 JP3.2
CAN1_H
  Top 0.508: IC2.7 5.43,31.98 K2.5 2.25,32.62 2.25,35.41 3.52,36.68 4.79,36.68 4.79,40.24 5.43,40.88 R15.2
CAN1_L
  Top 0.508: IC2.6 5.43,33.26 K2.6 5.17,35.54 5.3,35.54 5.81,36.05 R13.2
CAN1_MODE  (via drill 0.4)
  Top 0.254: IC1.67 24.63,33.1 23.21,34.52 v14.95,34.52
  Bottom 0.254: R33.1 v14.95,34.52
CAN1_RX
  Top 0.254: IC2.4 13.68,34.52 14.95,33.26 21.94,33.26 23.13,32.06 IC1.70
CAN1_TX
  Top 0.254: IC1.71 22.63,31.29 21.3,32.62 14.95,32.62 14.32,31.98 14.32,31.35 13.68,30.71 IC2.1
CAN2_H
  Top 0.508: R14.2 5.81,13.82 K2.1 5.43,16.74 IC3.7
CAN2_L
  Top 0.508: IC3.6 5.43,18.02 K2.2 2.25,17.38 2.25,14.59 3.52,13.32 4.79,13.32 4.79,9.12 R16.2
CAN2_MODE  (via drill 0.4)
  Top 0.254: IC1.96 16.79,16.17 v15.59,17.38
  Bottom 0.254: R34.1 13.68,15.47 v15.59,17.38
CAN2_RX
  Top 0.254: IC1.91 16.2,18.67 15.59,19.29 IC3.4
CAN2_TX
  Top 0.254: IC1.92 15.11,18.17 14.32,17.38 14.32,16.11 13.68,15.47 IC3.1
ETH_COL  (via drill 0.4)
  Top 0.254: IC4.40 48.37,7.11 v47.97,6.71 | IC1.26 32.76,14.17 30.83,16.11 v30.83,16.74
  Bottom 0.254: v30.83,16.74 31.46,16.74 40.35,7.86 46.7,7.86 v47.97,6.71
ETH_CRS
  Top 0.254: IC1.23 31.63,9.97 32.22,9.38 35.02,9.38 38.45,5.95 48.35,5.95 48.87,6.47 IC4.41
ETH_INTR  (via drill 0.4)
  Top 0.254: IC4.32 44.15,12.31 v43.52,12.94 | v31.33,26.4 31.13,26.6 IC1.54 31.13,29.64 R8.2
  Bottom 0.254: v31.33,26.4 32.48,25.38 33.75,24.11 33.75,18.27 38.57,13.44 41.62,13.44 41.87,13.7 42.76,13.7 v43.52,12.94
ETH_MDC  (via drill 0.4)
  Top 0.254: IC1.16 28.13,15.96 28.92,16.74 29.55,16.74 32.73,13.57 38.45,13.57 v39.08,14.21 | IC4.19 49.37,19.15 47.34,21.19 43.52,21.19 v42.89,20.55
  Bottom 0.254: v42.89,20.55 42.64,20.81 41.24,20.81 40.73,20.3 40.73,19.54 40.98,19.29 40.98,16.11 v39.08,14.21
ETH_MDIO  (via drill 0.4)
  Top 0.254: v40.35,14.21 39.08,12.94 34.64,12.94 33.87,12.17 IC1.25 | IC4.18 49.87,19.29 47.34,21.82 42.89,21.82 41.62,20.55 v41.62,19.92
  Bottom 0.254: v41.62,19.92 41.62,17.38 | R30.1 41.62,17.38 | 41.62,17.38 41.62,16.11 40.35,14.84 v40.35,14.21
ETH_RST  (via drill 0.4)
  Top 0.254: C12.1 55.59,7.98 R19.2 54.32,7.86 53.69,7.22 v52.41,7.22 51.87,7.76 IC4.47 | IC1.55 30.63,26.71 v30.19,26.27
  Bottom 0.254: v30.19,26.27 30.19,18.65 40.35,8.49 51.15,8.49 v52.41,7.22
ETH_RXCLK
  Top 0.254: IC4.28 42.36,14.31 39.72,11.66 35.91,11.66 34.25,10.01 32.6,10.01 32.13,10.48 IC1.24
ETH_RXD0
  Top 0.254: IC4.23 47.37,18.61 47.34,18.65 44.16,18.65 43.18,17.67 IC1.33
ETH_RXD1
  Top 0.254: IC4.22 47.87,18.75 47.34,19.29 44.16,19.29 43.05,18.17 IC1.34
ETH_RXD2
  Top 0.254: IC4.21 48.37,18.88 47.34,19.92 44.16,19.92 42.91,18.67 IC1.35
ETH_RXD3
  Top 0.254: IC4.20 48.87,19.02 47.34,20.55 44.16,20.55 42.78,19.17 IC1.36
ETH_RXDV
  Top 0.254: IC1.32 43.1,17.17 43.52,16.74 43.52,15.47 44.19,14.81 IC4.27
ETH_RXER  (via drill 0.4)
  Top 0.254: IC1.47 33.67,24.67 33.37,24.36 33.37,22.84 v32.86,22.33 | IC4.29 43.13,13.81 v42.26,12.94
  Bottom 0.254: v32.86,22.33 32.86,18.52 38.45,12.94 v42.26,12.94
ETH_TXCLK  (via drill 0.4)
  Top 0.254: IC1.18 29.13,13.78 v29.55,14.21 | IC4.33 40.5,11.81 39.72,11.03 37.18,11.03 v35.91,9.76
  Bottom 0.254: v29.55,14.21 32.09,14.21 35.91,10.39 v35.91,9.76
ETH_TXD0  (via drill 0.4)
  Top 0.254: IC4.35 42.67,10.81 v42.26,10.39 | IC1.51 32.63,24.9 v31.46,23.73
  Bottom 0.254: v42.26,10.39 41.62,9.76 40.35,9.76 31.46,18.65 v31.46,23.73
ETH_TXD1  (via drill 0.4)
  Top 0.254: IC4.36 44.08,10.31 v43.52,9.76 | IC1.52 32.13,25.67 v31.46,25
  Bottom 0.254: v43.52,9.76 42.89,9.12 40.35,9.12 30.83,18.65 30.83,23.09 30.7,23.22 30.7,24.24 v31.46,25
ETH_TXD2  (via drill 0.4)
  Top 0.254: IC1.17 28.63,15.19 v29.17,15.73 | IC4.38 47.37,7.89 46.7,7.22 39.72,7.22 v38.45,8.49
  Top 0.305: IC1.17 28.63,11.7
  Bottom 0.254: v29.17,15.73 31.84,15.73 38.45,9.12 v38.45,8.49
ETH_TXD3  (via drill 0.4)
  Top 0.254: 20.6,12.21 20.6,14.78 21.3,15.47 v26.13,15.47 | IC4.39 47.87,7.76 46.7,6.59 39.08,6.59 37.18,8.49 v37.18,9.12
  Top 0.305: 20.6,12.21 IC1.1
  Bottom 0.254: v26.13,15.47 28.29,15.47 28.79,14.97 31.97,14.97 37.18,9.76 v37.18,9.12
ETH_TXEN  (via drill 0.4)
  Top 0.254: IC4.34 41.27,11.31 v40.98,11.03 | v32.6,23.6 32.6,24.24 33.54,25.17 IC1.48
  Bottom 0.254: v40.98,11.03 39.72,11.03 32.09,18.65 32.09,23.09 v32.6,23.6
EXTSUPPLY  (via drill 0.4)
  Top 1.016: v9.24,44.69 9.24,46.59 D4.K
  Bottom 0.762: 4.79,37.06 4.79,41.51
  Bottom 1.016: K2.4 1.62,29.45 1.62,35.16 3.14,36.68 4.41,36.68 4.79,37.06 | 4.79,41.51 6.7,41.51 9.24,44.05 v9.24,44.69
  pour Top (no thermals): 7.33,44.05 10.51,44.05 11.78,45.32 11.78,47.86 12.41,48.5 22.57,48.5 23.84,47.23 23.84,45.32 24.48,44.69 30.19,44.69 30.83,45.32 30.83,47.86 31.46,48.5 38.06,48.5 38.06,42.78 39.08,42.78 39.08,45.95 39.72,46.59 42.26,46.59 43.52,45.32 46.7,45.32 47.34,45.95 47.34,49.77 46.7,50.4 7.33,50.4
GND1  (via drill 0.4)
  Top 0.254: IC2.2 v11.14,31.98 | 50.38,17.3 IC4.17 | v38.45,15.47 37.64,14.67 IC1.27 32.9,14.67 32.09,15.47 32.09,16.74 30.83,18.02 v29.55,18.02 | IC6.7 60.67,47.23 | IC3.2 v11.14,16.74 | IC1.10 25.13,14.18 v25.11,14.21
  Top 0.305: IC1.20 30.13,6.66 | IC1.99
  Bottom 0.254: K4.2 K3.2 | R32.2 v11.14,16.74 11.27,16.62 C22.2
  Bottom 1.016: K6.SH1 K6.SH2
  other vias: 48.73,11.41 48.73,14.33 39.08,24.36 15.59,15.47 11.78,11.03 21.94,5.95 31.46,5.32 52.41,44.69 64.48,43.41 51.15,35.8 46.7,29.45 47.34,3.41 68.92,11.66 78.45,10.39 51.78,23.73 60.67,25.64 20.67,37.7 23.84,25.64 26.38,30.08 38.45,27.54 65.12,4.68 7.97,7.22 60.67,12.94 62.58,35.16 58.77,17.38 65.12,18.02 18.12,27.54
  pour Top (isolate 0.203, rank 6, no thermals): -0.29,50.4 80.99,50.4 80.99,-0.4 -0.29,-0.4
  pour Bottom (no thermals): 51.15,34.52 51.15,22.46 61.3,22.46 61.3,34.52
  pour Bottom (isolate 0.203, rank 6, no thermals): -0.92,51.03 -0.92,-1.04 81.62,-1.04 81.62,51.03
  pour Top (no thermals): 58.77,4.68 58.77,0.23 72.73,0.23 72.73,4.68
LED_CAN1
  Top 0.254: IC1.83 17.7,22.67 16.86,21.82 R5.2
LED_CAN2
  Top 0.254: IC1.85 17.47,21.67 17.24,21.44 17.24,20.94 16.86,20.55 R7.2
LED_GLOBAL
  Top 0.254: IC1.57 29.63,29.87 R9.2
N$1
  Top 0.254: IC6.3 59.53,42.14 59.15,42.53 59.15,44.43 59.4,44.69 IC6.5 62.58,44.69 63.21,45.32 66.92,45.32 D2.K 67.91,43.54 R17.1
N$2
  Top 0.254: IC1.49 33.45,25.67 33.11,26.02 33.11,26.65 34.64,28.18 34.64,30.16 C7.+
N$3
  Top 0.254: K6.K_Y 76.75,17.59 72.73,13.57 64.48,13.57 58.77,7.86 58.77,7.22 58.13,6.59 R20.2
N$4
  Top 0.254: IC1.73 21.63,29.8 C8.+
  Top 0.305: IC1.73 21.63,28.09 21.62,28.05
N$5
  Top 0.508: R16.1 JP2.1
N$7
  Top 0.254: R10.2 D1.A
N$8
  Top 0.254: K6.K_G 76.75,20.76 77.81,19.7 77.81,18.02 72.73,12.94 64.48,12.94 59.4,7.86 59.4,6.59 58.13,5.32 R21.2
N$9  (via drill 0.4)
  Top 0.254: IC4.7 55.09,13.31 C10.2
  Bottom 0.254: C26.+ C10.2
  Bottom 1.016: L1.2 54.75,12.78 C26.+
  other vias: 55.46,12.94
N$10
  Top 0.508: R14.1 JP2.3
N$11
  Bottom 0.508: C32.2 2.25,10.39 | 2.25,10.39 2.25,11.54 JP2.4 | JP2.2 2.12,10.27 2.25,10.39
N$12  (via drill 0.4)
  Top 0.254: IC2.8 v7.97,30.71
  Bottom 0.254: R33.2 R31.2 R28.1 9.11,31.22 8.6,30.71 v7.97,30.71
N$14
  Top 0.254: R5.1 14.82,22.33 14.95,22.46 14.95,27.54 13.68,28.81 LD1.K
N$16
  Top 0.508: R13.1 JP1.1
N$17  (via drill 0.4)
  Top 0.254: IC3.8 v7.97,15.47
  Bottom 0.254: v7.97,15.47 R34.2 R32.1 R29.2
N$18
  Top 0.508: R15.1 JP1.3
N$19
  Bottom 0.508: C33.2 2.25,39.61 | JP1.4 2.12,39.73 2.25,39.61 | JP1.2 2.12,39.48 2.25,39.61
N$20
  Top 0.254: R7.1 11.78,20.55 LD2.K
N$21
  Top 0.254: LD3.K 11.14,37.06 12.41,35.8 16.22,35.8 16.86,35.16 23.21,35.16 25.11,33.26 25.11,32.62 26.38,31.35 29.43,31.35 R9.1
N$22
  Top 0.254: K4.1 73.37,38.97 | 73.37,38.97 74.64,38.97 75.28,38.34 76.55,38.34 77.18,38.97 78.45,38.97 K4.3 | R18.2 70.83,39.61 71.47,38.97 73.37,38.97
N$23
  pour Bottom: 58.77,0.23 72.73,0.23 72.73,4.68 58.77,4.68
N$24
  Top 0.254: K3.3 78.45,37.06 77.18,37.06 76.55,37.7 75.28,37.7 74.64,37.06 73.37,37.06 | K3.1 73.37,37.06 | R17.2 68.92,40.24 72.1,37.06 73.37,37.06
N$28  (via drill 0.4)
  Bottom 0.254: L2.1 v34,45.95
  other vias: 32.73,45.95 35.27,45.95 35.91,47.23 34.64,47.23 33.37,47.23 32.09,47.23
  pour Top (rank 2, no thermals): 30.83,48.5 37.81,48.5 37.81,42.78 33.37,42.78 30.83,45.32
N$29
  pour Top (no thermals): 39.08,40.24 39.08,36.43 41.62,36.43 41.62,40.24
N$30
  Top 0.254: IC6.11 56.86,43.41 57.5,44.05 57.5,45.32 56.86,45.95 IC6.9 54.32,45.95 53.69,46.59 53.69,47.86 54.32,48.5 57.24,48.5 59.15,46.59 62.83,46.59 63.21,46.21 70.58,46.21 70.83,45.95 D3.K R18.1
N$36  (via drill 0.4)
  Top 0.254: IC4.4 55.32,11.81 C11.2 v55.34,11.54
  Top 0.305: IC4.4 53.32,11.81 53.3,11.79 50.64,11.79 49.62,12.81 45.38,12.81 IC4.31 45.37,12.81
  Bottom 0.254: v55.34,11.54 55.34,11.59 C30.+
N$37
  Top 0.254: IC4.9 61.41,14.31 63.21,16.11 63.21,21.19 63.84,21.82 K6.8
N$38
  Top 0.254: IC4.10 61.28,14.81 62.58,16.11 62.58,21.82 63.84,23.09 K6.7
N$39
  Top 0.254: IC4.11 59.87,15.31 61.3,16.74 61.3,23.09 62.58,24.36 62.58,28.18 63.84,29.45 K6.2
N$40
  Top 0.254: IC4.12 59.74,15.81 60.67,16.74 60.67,23.73 61.94,25 61.94,28.81 63.84,30.71 K6.1
N$41
  Top 0.254: K6.4 R2.2
N$42
  Top 0.254: K6.9 68.29,20.55 68.92,21.19 R3.2
N$43
  Top 0.254: K6.10 68.92,19.29 70.19,20.55 R4.2
N$44
  Top 0.254: K6.5 R1.2
N$45
  Top 0.254: 69.56,25.64 69.56,26.91 R2.1 | R1.1 69.56,25.64 | 69.56,25.64 69.56,23.22 | R3.1 69.56,23.22 | 69.56,23.22 R4.1 72.51,23.22 C1.1
N$46
  Top 0.254: K6.6 C2.2
N$47
  Top 0.254: K6.3 C3.2
N$49
  Top 0.254: IC4.16 50.87,19.01 51.15,19.29 R6.2
N$50
  Top 0.254: IC4.42 49.37,7.72 51.78,5.32 R21.1
N$51
  Top 0.254: IC4.43 49.87,7.86 51.78,5.95 53.69,5.95 54.32,6.59 R20.1
N$55
  Top 0.254: IC4.14 51.87,18.36 52.16,18.65 55.59,18.65 55.59,20.55 56.39,21.36 X1.3 56.73,21.32 C6.2
N$56
  Top 0.254: IC4.15 51.37,18.5 52.41,19.54 C5.2 54.45,19.79 X1.1
NRST  (via drill 0.4)
  Top 0.254: C19.1 R26.1 K5.5 | IC1.14 27.13,15.99 26.76,16.36 v21.55,16.36
  Bottom 0.254: v21.55,16.36 21.55,14.46 18.12,11.03 18.12,5.32 17.49,4.68 14.95,4.68 K5.5
OSC_IN
  Top 0.254: IC1.12 26.13,7.86 25.62,7.35 25.05,7.35 X2.1 | 24.99,7.41 X2.1 | C15.1 25,7.35 X2.1
OSC_OUT
  Top 0.254: IC1.13 26.63,9.56 X2.3 27.26,8.93 C14.1
SWD_SWCLK  (via drill 0.4)
  Top 0.254: IC1.76 20.76,26.17 21.3,25.64 v21.3,19.92 | R24.1 K5.2
  Top 0.305: 19.05,26.21 IC1.76
  Bottom 0.254: v21.3,19.92 21.94,19.92 23.21,18.65 23.21,14.84 19.4,11.03 19.4,2.77 K5.2
SWD_SWDIO  (via drill 0.4)
  Top 0.254: IC1.72 22.13,18.85 v21.94,18.65 | R25.2 K5.4
  Bottom 0.254: v21.94,18.65 22.57,18.02 22.57,14.84 18.76,11.03 18.76,4.68 18.12,4.05 16.86,4.05 K5.4
SWD_SWO  (via drill 0.4)
  Top 0.254: IC1.89 20.28,19.67 20.67,19.29 v20.67,18.65 | R27.2 K5.6
  Bottom 0.254: v20.67,18.65 20.67,14.21 17.49,11.03 17.49,5.95 16.86,5.32 13.05,5.32 K5.6
TRIG1I
  Top 0.254: IC1.43 39.93,22.67 42.26,25 46.7,25 57.62,35.92 57.62,41.38 56.86,42.14 IC6.12
TRIG1O
  Top 0.254: IC1.42 40.06,22.17 42.26,24.36 46.7,24.36 58.13,35.8 58.13,46.59 57.5,47.23 IC6.8
TRIG1OE
  Top 0.254: IC1.44 39.79,23.17 42.26,25.64 46.7,25.64 57.11,36.05 57.11,40.62 56.86,40.88 IC6.13
TRIG2I
  Top 0.254: IC1.41 40.2,21.67 42.26,23.73 46.7,23.73 58.64,35.67 58.64,45.83 58.77,45.95 IC6.6
TRIG2O
  Top 0.254: IC1.40 40.33,21.17 42.26,23.09 46.7,23.09 59.15,35.54 59.15,40.62 59.4,40.88 IC6.2
TRIG2OE
  Top 0.254: IC1.39 40.47,20.67 42.26,22.46 46.7,22.46 59.65,35.41 59.65,39.22 60.03,39.61 IC6.1
USART3_RX
  Top 0.254: IC1.79 17.16,24.67 K1.4
USART3_TX
  Top 0.254: IC1.78 17.32,25.17 K1.2

### Text on the board
tRestrict: v2.0 | CanShark
bRestrict: CAN | v2.0 | CanShark